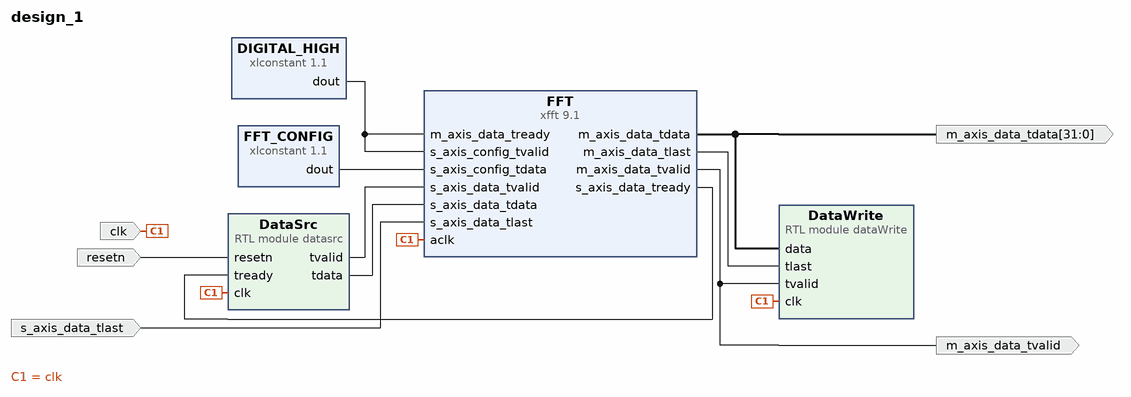
[diagram p0: block diagram of the top level]
# Vivado block design design_1, xc7z020clg484-1, Vivado 2020.2
create_bd_design design_1

create_bd_port -dir I -type clk clk
create_bd_port -dir O -from 31 -to 0 m_axis_data_tdata
create_bd_port -dir O m_axis_data_tvalid
create_bd_port -dir I -type rst resetn
create_bd_port -dir I s_axis_data_tlast

create_bd_cell -type ip -vlnv xilinx.com:ip:xfft:9.1 FFT
set_property -dict [list \
  CONFIG.implementation_options pipelined_streaming_io \
  CONFIG.input_width 16 \
  CONFIG.number_of_stages_using_block_ram_for_data_and_phase_factors 0 \
  CONFIG.output_ordering natural_order \
  CONFIG.scaling_options scaled \
  CONFIG.transform_length 32 \
] [get_bd_cells FFT]
create_bd_cell -type module -reference datasrc DataSrc
create_bd_cell -type ip -vlnv xilinx.com:ip:xlconstant:1.1 FFT_CONFIG
set_property -dict {CONFIG.CONST_VAL b00000001 CONFIG.CONST_WIDTH 8} [get_bd_cells FFT_CONFIG]
create_bd_cell -type ip -vlnv xilinx.com:ip:xlconstant:1.1 DIGITAL_HIGH
create_bd_cell -type module -reference dataWrite DataWrite

# ---- connections ----

connect_bd_net -net aclk_0_1 [get_bd_ports clk] [get_bd_pins FFT/aclk] [get_bd_pins DataSrc/clk] [get_bd_pins DataWrite/clk]
connect_bd_net -net datasrc_0_tvalid [get_bd_pins DataSrc/tvalid] [get_bd_pins FFT/s_axis_data_tvalid]
connect_bd_net -net xfft_0_s_axis_data_tready [get_bd_pins FFT/s_axis_data_tready] [get_bd_pins DataSrc/tready]
connect_bd_net -net datasrc_0_tdata [get_bd_pins DataSrc/tdata] [get_bd_pins FFT/s_axis_data_tdata]
connect_bd_net -net xlconstant_1_dout [get_bd_pins DIGITAL_HIGH/dout] [get_bd_pins FFT/s_axis_config_tvalid] [get_bd_pins FFT/m_axis_data_tready]
connect_bd_net -net xfft_0_m_axis_data_tdata [get_bd_pins FFT/m_axis_data_tdata] [get_bd_ports m_axis_data_tdata] [get_bd_pins DataWrite/data]
connect_bd_net -net xfft_0_m_axis_data_tvalid [get_bd_pins FFT/m_axis_data_tvalid] [get_bd_ports m_axis_data_tvalid] [get_bd_pins DataWrite/tvalid]
connect_bd_net -net resetn_0_1 [get_bd_ports resetn] [get_bd_pins DataSrc/resetn]
connect_bd_net -net s_axis_data_tlast_0_1 [get_bd_ports s_axis_data_tlast] [get_bd_pins FFT/s_axis_data_tlast]
connect_bd_net -net xlconstant_0_dout [get_bd_pins FFT_CONFIG/dout] [get_bd_pins FFT/s_axis_config_tdata]
connect_bd_net -net xfft_0_m_axis_data_tlast [get_bd_pins FFT/m_axis_data_tlast] [get_bd_pins DataWrite/tlast]

validate_bd_design
save_bd_design
